# Altium schematic sheet moo-moo-FOC.SchDoc
size A4; SheetNumber: 1; SheetTotal: 1
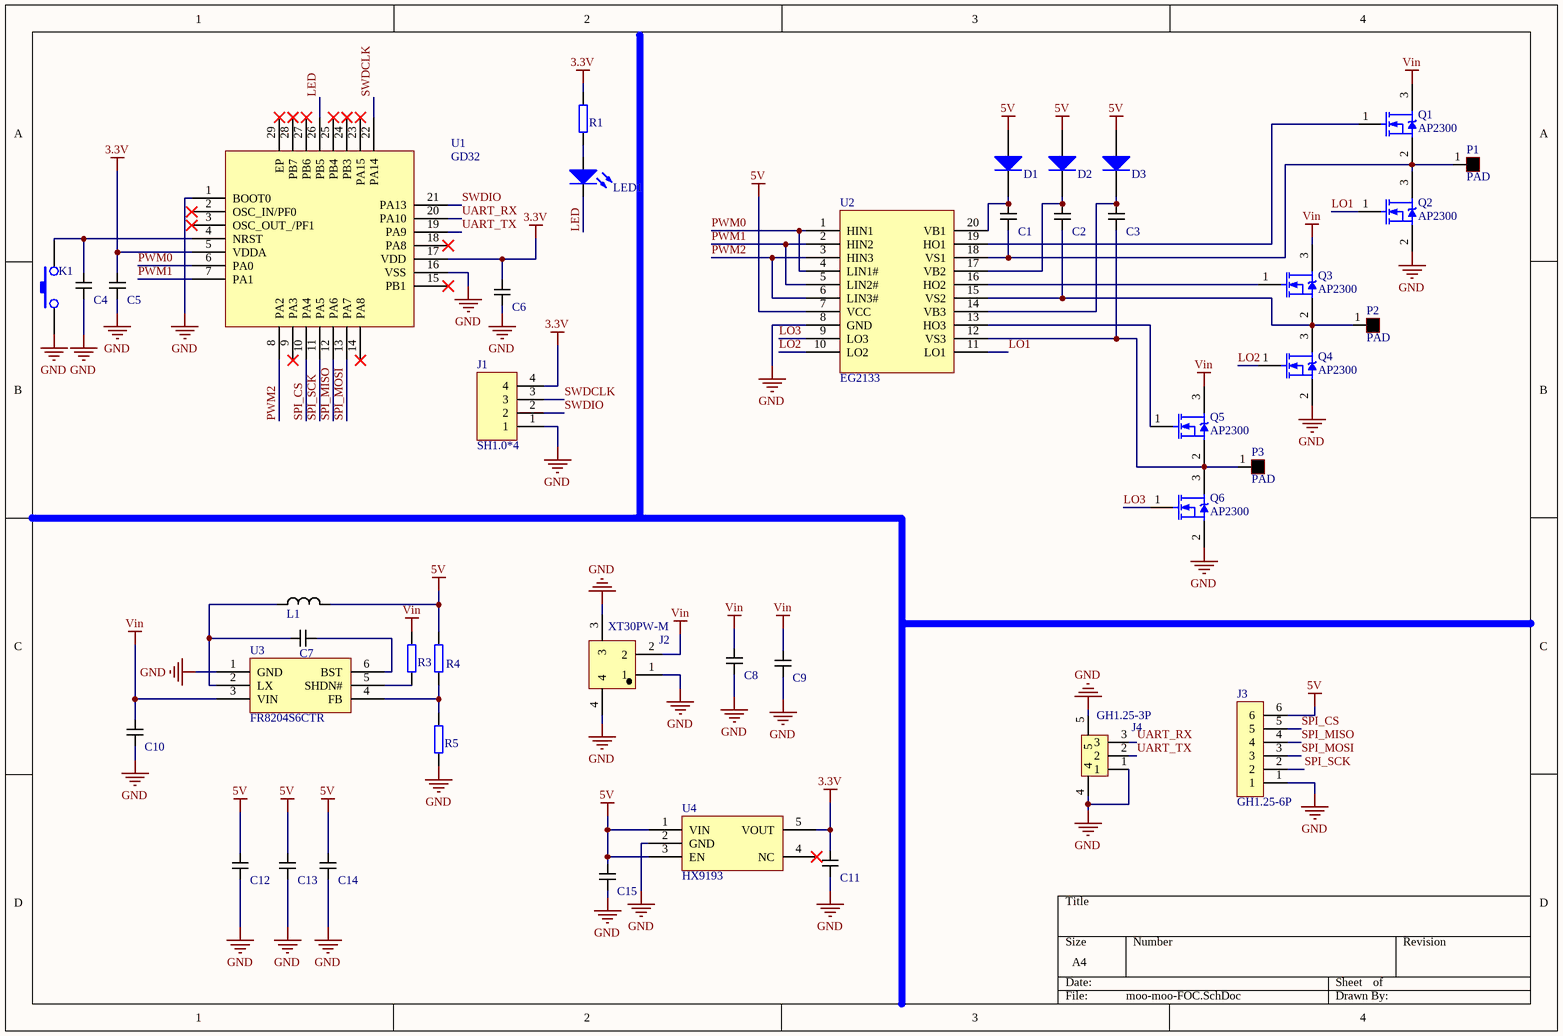
[diagram p0: moo-moo-FOC.SchDoc]

## Parts
C1  100nF  [0603-CAP]  (value not drawn)
C2  100nF  [0603-CAP]  (value not drawn)
C3  100nF  [0603-CAP]  (value not drawn)
C4  100nF  [0603-CAP]  (value not drawn)
C5  100nF  [0603-CAP]  (value not drawn)
C6  100nF  [0603-CAP]  (value not drawn)
C7  100nF  [0603-CAP]  (value not drawn)
C8  10uF  [0603-CAP]  (value not drawn)
C9  10uF  [0603-CAP]  (value not drawn)
C10  10uF  [0603-CAP]  (value not drawn)
C11  100nF  [0603-CAP]  (value not drawn)
C12  10uF  [0603-CAP]  (value not drawn)
C13  10uF  [0603-CAP]  (value not drawn)
C14  10uF  [0603-CAP]  (value not drawn)
C15  100nF  [0603-CAP]  (value not drawn)
D1  二极管  [二极管]  (value not drawn)
D2  二极管  [二极管]  (value not drawn)
D3  二极管  [二极管]  (value not drawn)
J1  SH1.0*4  [SH1.0-WT-4P]
J2  XT30PW-M  [XT30PW-M公头]
J3  GH1.25-6P  [GH1.25-WT-6P]
J4  GH1.25-3P  [GH1.25-WT-3P]
K1  key  [轻触开关]  (value not drawn)
L1  4.7uH  [功率电感]  (value not drawn)
LED1  发光二极管  [0603-LED]  (value not drawn)
P1  PAD  [PAD]
P2  PAD  [PAD]
P3  PAD  [PAD]
Q1  AP2300  [AP2300]
Q2  AP2300  [AP2300]
Q3  AP2300  [AP2300]
Q4  AP2300  [AP2300]
Q5  AP2300  [AP2300]
Q6  AP2300  [AP2300]
R1  10k  [0603-RES]  (value not drawn)
R3  100K  [0603-RES]  (value not drawn)
R4  30.9K  [0603-RES]  (value not drawn)
R5  5.76K  [0603-RES]  (value not drawn)
U1  GD32  [QFN-28-0.4]
U2  EG2133  [EG2133]
U3  FR8204S6CTR  [FR8204]
U4  HX9193  [HX9193]

## Nets
3.3V: C5.1 C6.1 C11.1 J1.4 R1.1 U1.5(VDDA) U1.17(VDD) U4.5(VOUT)
5V: C12.1 C13.1 C14.1 C15.1 D1.1(A) D2.1(A) D3.1(A) J3.6 L1.2 R4.1 U2.7(VCC) U4.1(VIN) U4.3(EN)
GND: C4.2 C5.2 C6.2 C8.2 C9.2 C10.2 C11.2 C12.2 C13.2 C14.2 C15.2 J1.1 J2.1 J2.3 J2.4 J3.1 J4.1 J4.4 J4.5 K1.1 Q2.2(S) Q4.2(S) Q6.2(S) R5.2 U1.1(BOOT0) U1.16(VSS) U2.8(GND) U3.1(GND) U4.2(GND)
Vin: C8.1 C9.1 C10.1 J2.2 Q1.3 Q3.3 Q5.3 R3.1 U3.3(VIN)
LED: LED1.2 U1.26(PB5)
LO1: Q2.1(G) U2.11(LO1)
LO2: Q4.1(G) U2.10(LO2)
LO3: Q6.1(G) U2.9(LO3)
PWM0: U1.6(PA0) U2.1(HIN1) U2.4(LIN1#)
PWM1: U1.7(PA1) U2.2(HIN2) U2.5(LIN2#)
PWM2: U1.8(PA2) U2.3(HIN3) U2.6(LIN3#)
SPI_CS: J3.5 U1.10(PA4)
SPI_MISO: J3.4 U1.12(PA6)
SPI_MOSI: J3.3 U1.13(PA7)
SPI_SCK: J3.2 U1.11(PA5)
SWDCLK: J1.3 U1.22(PA14)
SWDIO: J1.2 U1.21(PA13)
UART_RX: J4.3 U1.20(PA10)
UART_TX: J4.2 U1.19(PA9)
NetC1_1: C1.1 D1.2(K) U2.20(VB1)
NetC1_2: C1.2 P1.1 Q1.2(S) Q2.3 U2.18(VS1)
NetC2_1: C2.1 D2.2(K) U2.17(VB2)
NetC2_2: C2.2 P2.1 Q3.2(S) Q4.3 U2.15(VS2)
NetC3_1: C3.1 D3.2(K) U2.14(VB3)
NetC3_2: C3.2 P3.1 Q5.2(S) Q6.3 U2.12(VS3)
NetC4_1: C4.1 K1.2 U1.4(NRST)
NetC7_1: C7.1 L1.1 U3.2(LX)
NetC7_2: C7.2 U3.6(BST)
NetLED1_1: LED1.1 R1.2
NetQ1_1: Q1.1(G) U2.19(HO1)
NetQ3_1: Q3.1(G) U2.16(HO2)
NetQ5_1: Q5.1(G) U2.13(HO3)
NetR3_2: R3.2 U3.5(SHDN#)
NetR4_2: R4.2 R5.1 U3.4(FB)

Not connected (* = marked no-connect by the designer): U1 2(OSC_IN/PF0)* 3(OSC_OUT_/PF1)* 9(PA3)* 14(PA8)* 15(PB1)* 18(PA8)* 23(PA15)* 24(PB3)* 25(PB4)* 27(PB6)* 28(PB7)* 29(EP)*; U4 4(NC)*

## Library data of the parts
C1-C15 = 电容: 无极性贴片电容
D1-D3 = 二极管: 通用二极管
J2 = XT30PW-M公头
K1 = 轻触开关: 按键
L1 = 电感: 普通电感; Code_IEC: 1005; Published: 8-Jun-2000; LatestRevisionDate: 29-May-2009; LatestRevisionNote: IPC-7351 Footprint Added.; PackageReference: 0402-A; Publisher: Altium Limited; PackageDescription: Chip Inductor; Code_JEITA: 0402
Q1-Q6 = AP2300: BOM名称: N沟道场效应管; 8元以下特价购入的买家: 还可以联系卖家远程指导AD软件使用
R1 R3-R5 = 电阻
U1 = GD32F130G6U6TR
U4 = HX9193-33GB